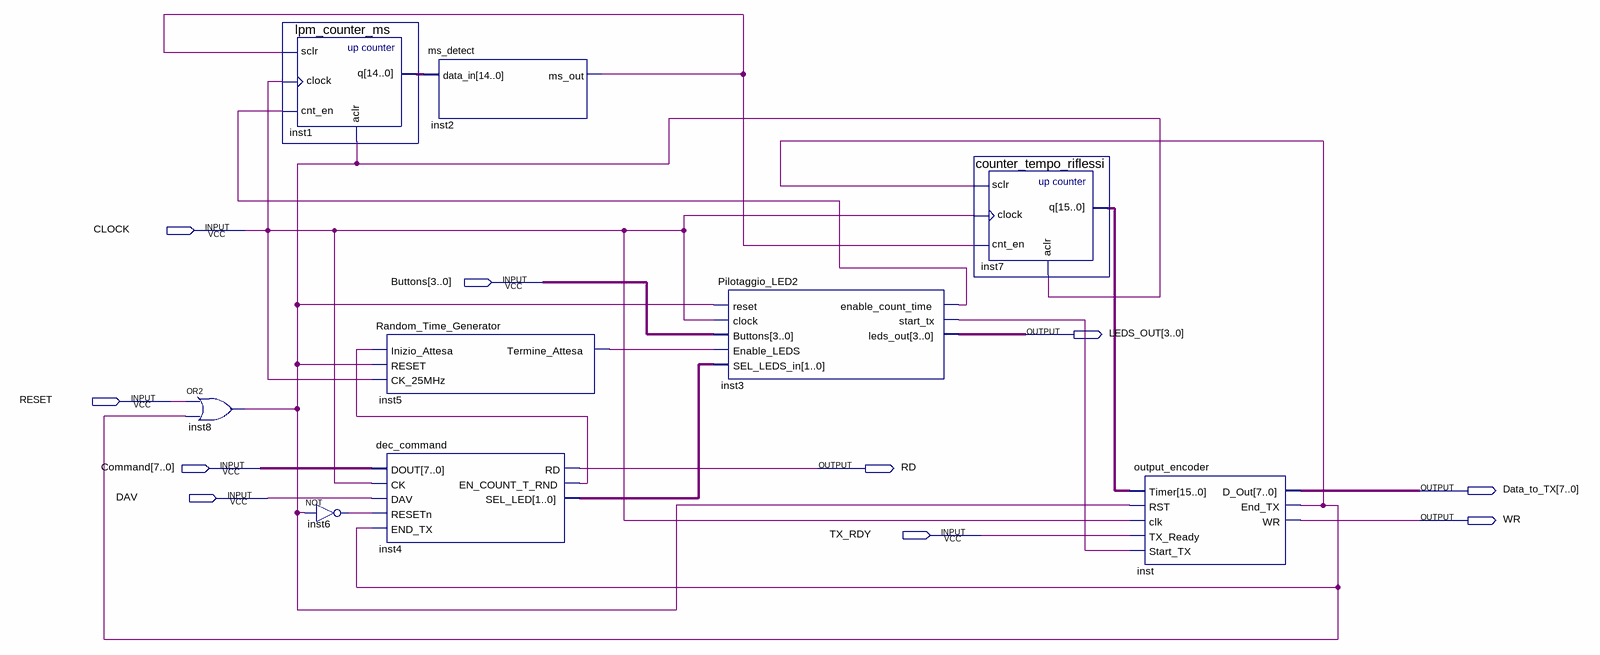
[diagram p0: schematic sheet]
// Quartus schematic Rilevatore_Riflessi_Completo.bdf as structural Verilog: 9 symbols, 10 pins
module Rilevatore_Riflessi_Completo (
  input  CLOCK,
  input  [3:0] Buttons,
  input  RESET,
  input  [7:0] Command,
  input  DAV,
  input  TX_RDY,
  output [3:0] LEDS_OUT,
  output RD,
  output [7:0] Data_to_TX,
  output WR
);

  wire inst2_ms_out, inst3_enable_count_time, inst3_start_tx, inst4_en_count_t_rnd, inst5_termine_attesa,
       inst6_out, inst8_out, inst_end_tx;
  wire [1:0] inst4_sel_led;
  wire [14:0] inst1_q;
  wire [15:0] inst7_q;

  or inst8 (inst8_out, RESET, inst_end_tx);
  lpm_counter_ms inst1 (
    .sclr(inst2_ms_out), .clock(CLOCK), .cnt_en(inst3_enable_count_time), .aclr(inst8_out), .q(inst1_q));
  not inst6 (inst6_out, inst8_out);
  Random_Time_Generator inst5 (
    .Inizio_Attesa(inst4_en_count_t_rnd), .RESET(inst8_out), .CK_25MHz(CLOCK),
    .Termine_Attesa(inst5_termine_attesa));
  dec_command inst4 (
    .DOUT(Command), .CK(CLOCK), .DAV(DAV), .RESETn(inst6_out), .END_TX(inst_end_tx), .RD(RD),
    .EN_COUNT_T_RND(inst4_en_count_t_rnd), .SEL_LED(inst4_sel_led));
  ms_detect inst2 (.data_in(inst1_q), .ms_out(inst2_ms_out));
  Pilotaggio_LED2 inst3 (
    .reset(inst8_out), .clock(CLOCK), .Buttons(Buttons), .Enable_LEDS(inst5_termine_attesa),
    .SEL_LEDS_in(inst4_sel_led), .enable_count_time(inst3_enable_count_time), .start_tx(inst3_start_tx),
    .leds_out(LEDS_OUT));
  counter_tempo_riflessi inst7 (
    .sclr(inst_end_tx), .clock(CLOCK), .cnt_en(inst2_ms_out), .aclr(inst8_out), .q(inst7_q));
  output_encoder inst (
    .Timer(inst7_q), .RST(inst8_out), .clk(CLOCK), .TX_Ready(TX_RDY), .Start_TX(inst3_start_tx),
    .D_Out(Data_to_TX), .End_TX(inst_end_tx), .WR(WR));
endmodule
